# EasyEDA Pro project ProProject_Yuzuki Chameleon_2023-09-02.epro, board 100ASK
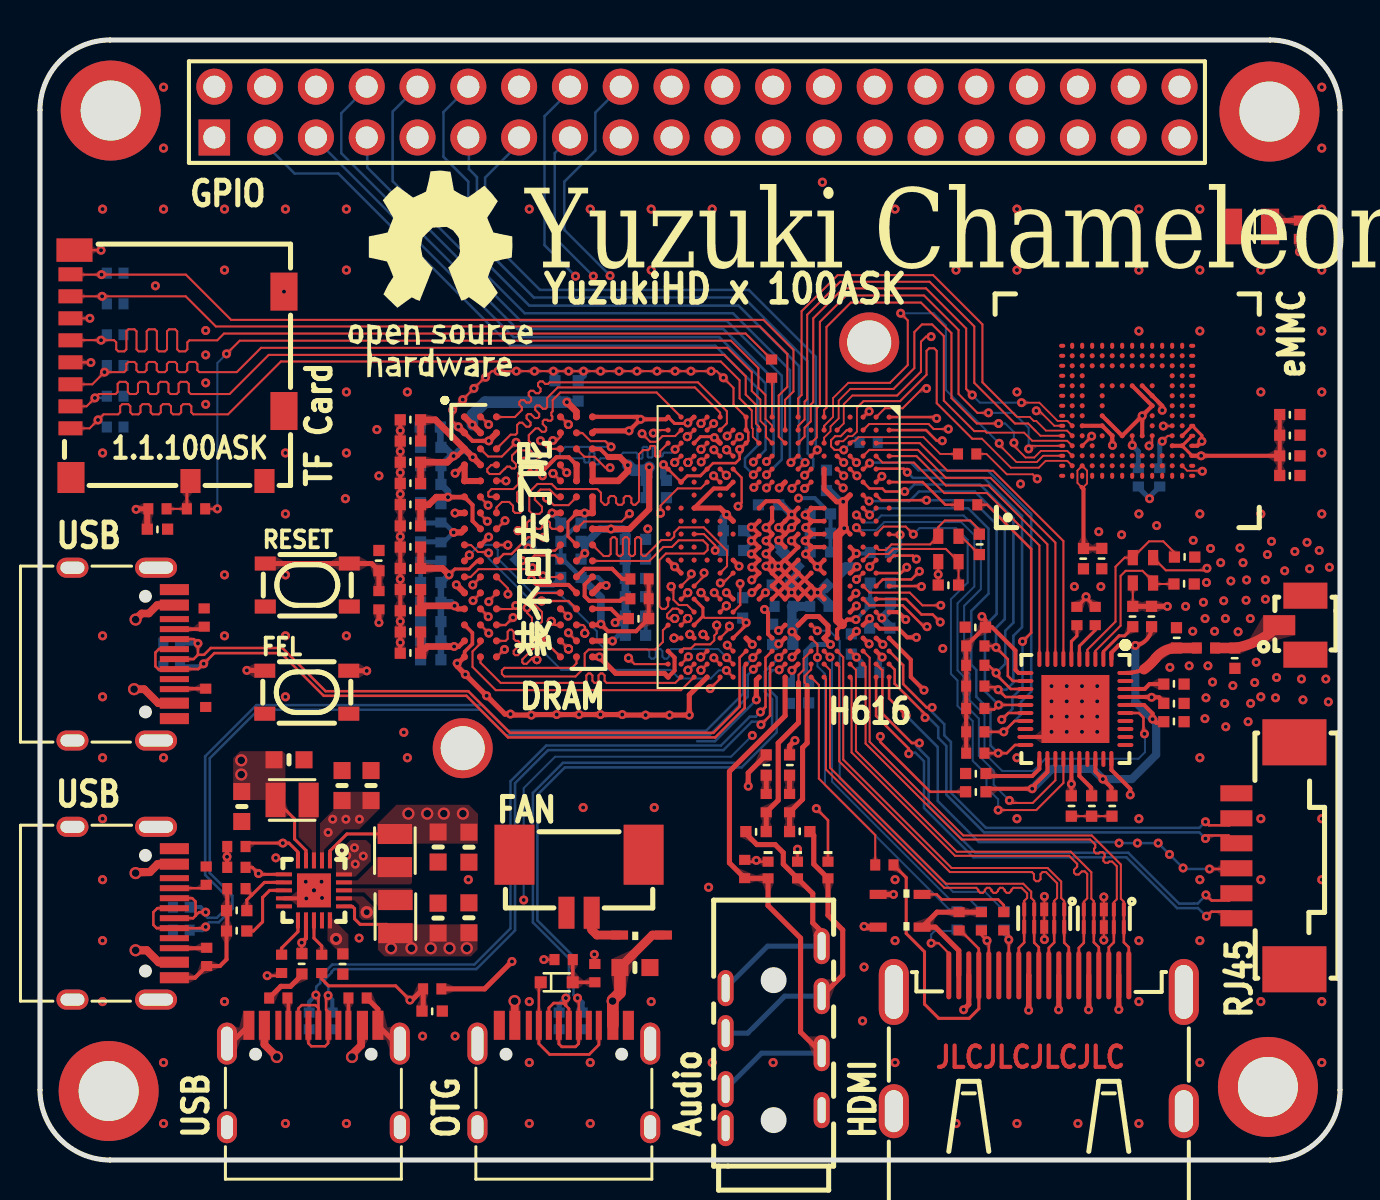
[diagram p14: board, top side]
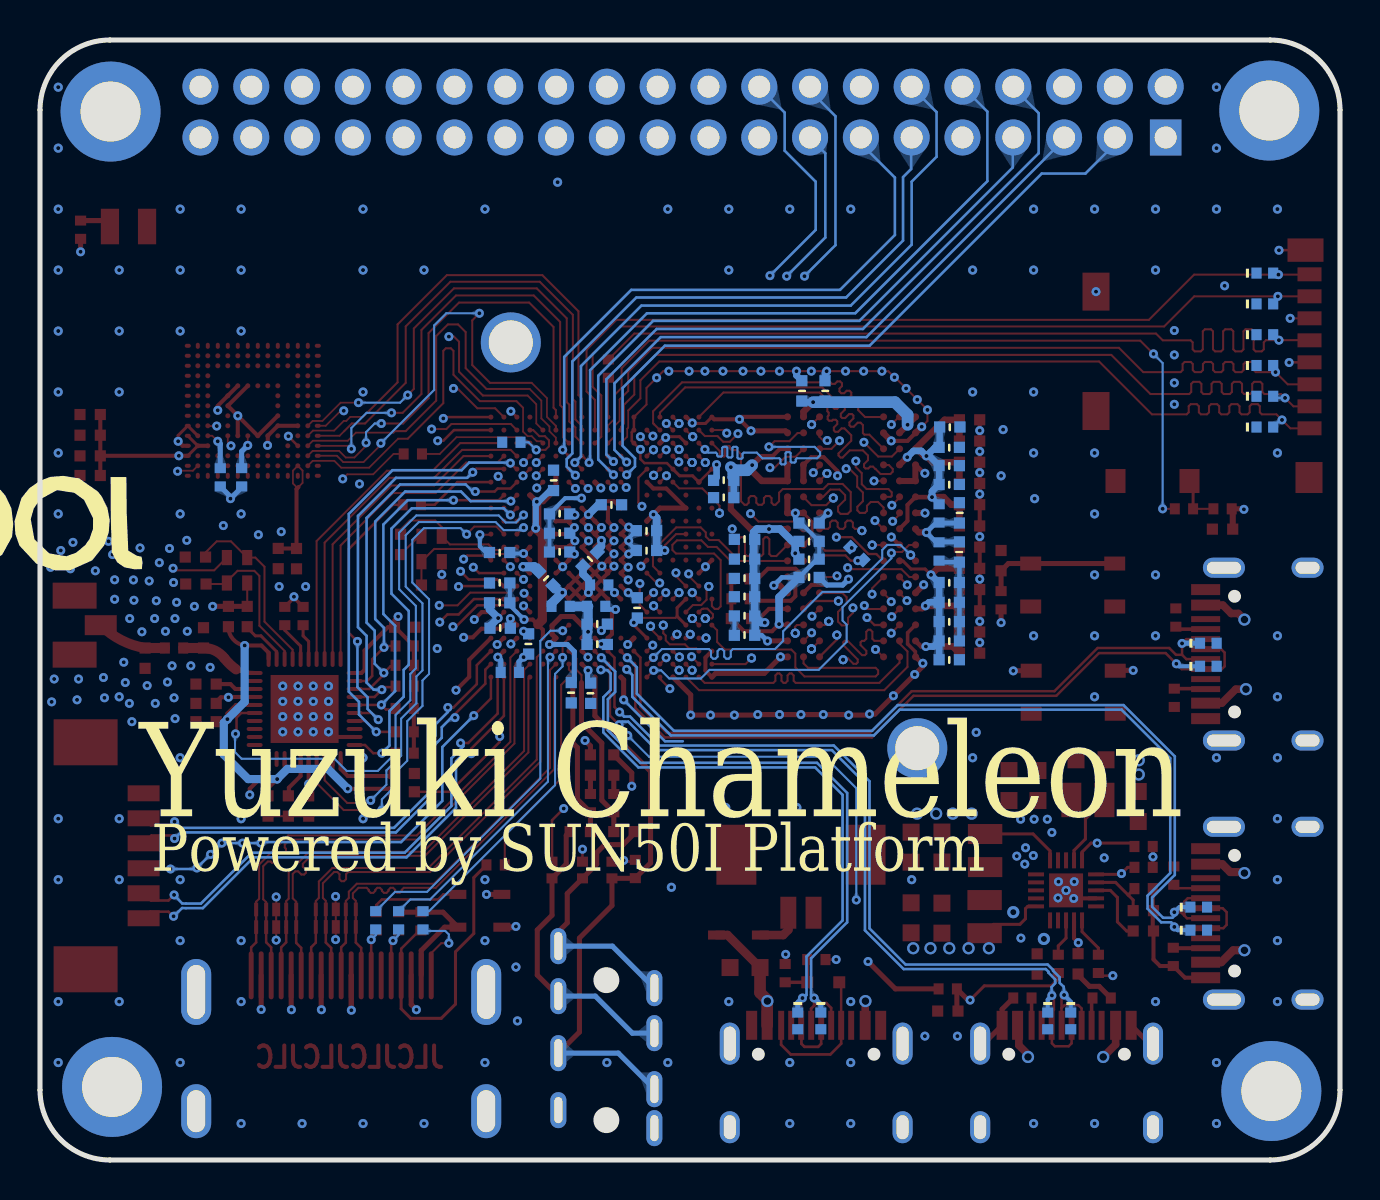
[diagram p15: board, bottom side, seen from below]

Outline 65 x 56 mm; copper layers: Top Layer, Inner1, Inner2, Inner3, Inner4, Bottom Layer. Coordinates in mm from the lower left corner of the outline.
Outline path: 0,52.5 0,3.5 arc(1.03,1.03) 3.5,0 61.5,0 arc(63.97,1.03) 65,3.5 65,52.5 arc(63.97,54.97) 61.5,56 3.5,56 arc(1.03,54.97) 0,52.5
Stack: Top Layer 0.035mm / Dielectric1 0.274mm PP er 4.5 / Inner1 0.035mm / Dielectric2 0.274mm PP er 4.5 / Inner2 0.035mm / Dielectric3 0.274mm FR4 er 4.5 / Inner3 0.035mm / Dielectric4 0.274mm PP er 4.5 / Inner4 0.035mm / Dielectric5 0.274mm PP er 4.5 / Bottom Layer 0.035mm

## Design rules (mm)
net SDQS1N: DP1
net SCKN: DP3
net SDQS1P: DP1
net SCKP: DP3
net HDMI_CP: DP5
net HDMI_0N: DP6
net HDMI_0P: DP6
net HDMI_1N: DP7
net HDMI_1P: DP7
net HDMI_2N: DP8
net HDMI_2P: DP8
net HDMI_CN: DP5
net D1+: DP4
net D1-: DP4
net D3+: DP10
net D3-: DP10
net D2+: DP9
net D2-: DP9
net D0+: DP11
net D0-: DP11
net EPHY_RXN: DP13
net EPHY_RXP: DP13
net EPHY_TXN: DP12
net EPHY_TXP: DP12
spacing safeClearance (default): track to track 0.089, other pairs 0.089 to 0.3
track width trackWidth (default): min 0.089, default 0.102, max 2.54
differential pair differentialPair (default): width min 0.102, default 0.254, max 2.54; gap min 0.102, default 0.102
via viaSize (default): diameter min 0.45, default 0.45, max 10; hole min 0.201, default 0.201, max 5.999
net VCC_DRAM uses DRAMCopper
pour e1065 uses DRAMCopper
pour e1494 uses DRAMCopper
pour e10340 uses DRAMCopper
pour e297 uses DRAMCopper

## Placement (name value [footprint] x y rotation side)
AUDIO1  -  [AUDIO-TH_PJ-3930-8A]  36.68 6.14 180 top
C1  4.7uf  [C0402-NSK]  15.14 9.8 90 top
C2  4.7uf  [C0603 NSK]  29.75 9.62 0 top
C3  4.7uf  [C0402-NSK]  13.1 9.81 90 top
C4  22uf  [C0603 NSK]  21.45 12.11 90 top
C5  4.7uf  [C0402-NSK]  9.83 12.47 0 top
C6  22uf  [C0603 NSK]  19.9 12.09 90 top
C7  4.7uf  [C0603 NSK]  16.55 18.72 90 top
C8  22uf  [C0603 NSK]  19.9 15.65 270 top
C9  22uf  [C0603 NSK]  21.45 15.64 270 top
C10  4.7uf  [C0603 NSK]  15.1 18.72 90 top
C11  22uf  [C0603 NSK]  10.09 17.67 270 top
C12  1uf  [C0402-NSK]  9.83 11.45 0 top
C13  22uf  [C0603 NSK]  12.45 20.01 0 top
C14  100nF  [C0402-NSK]  38.43 23.36 90 bottom
C15  100nF  [C0402-NSK]  37.47 23.34 90 bottom
C16  100nF  [C0402-NSK]  35.13 27.61 90 bottom
C17  100nF  [C0402-NSK]  29.77 30.04 180 bottom
C18  100nF  [C0402-NSK]  34.67 30.48 0 bottom
C19  100nF  [C0402-NSK]  29.77 31.03 180 bottom
C20  100nF  [C0402-NSK]  34.67 31.47 0 bottom
C21  100nF  [C0402-NSK]  39.02 31.34 180 bottom
C22  100nF  [C0402-NSK]  39.02 30.4 180 bottom
C23  100nF  [C0402-NSK]  39.02 32.3 180 bottom
C24  100nF  [C0402-NSK]  37.49 30.04 135 bottom
C25  100nF  [C0402-NSK]  36.43 32.76 0 bottom
C26  100nF  [C0402-NSK]  42.02 27.86 180 bottom
C27  100nF  [C0402-NSK]  39.32 33.98 270 bottom
C28  100nF  [C0402-NSK]  5.87 31.54 180 top
C29  100nF  [C0402-NSK]  42.02 28.85 180 bottom
C30  100nF  [C0402-NSK]  29.77 26.23 180 bottom
C31  100nF  [C0402-NSK]  19.54 27.89 0 bottom
C32  100nF  [C0402-NSK]  29.93 27.07 180 top
C33  100nF  [C0402-NSK]  19.54 28.88 0 bottom
C34  100nF  [C0402-NSK]  19.54 33.78 0 bottom
C35  100nF  [C0402-NSK]  18.52 32.77 0 top
C36  100nF  [C0402-NSK]  18.52 34.89 0 top
C37  100nF  [C0402-NSK]  19.54 26.92 0 bottom
C38  100nF  [C0402-NSK]  19.54 25.01 0 bottom
C39  100nF  [C0402-NSK]  29.77 27.2 180 bottom
C40  100nF  [C0402-NSK]  19.54 35.63 0 bottom
C41  100nF  [C0402-NSK]  26.55 31.85 180 bottom
C42  100nF  [C0402-NSK]  18.52 33.83 0 top
C43  100nF  [C0402-NSK]  18.52 35.95 0 top
C44  100nF  [C0402-NSK]  25.75 38.46 270 bottom
C45  100nF  [C0402-NSK]  29.77 28.16 180 bottom
C46  100nF  [C0402-NSK]  19.51 36.65 0 bottom
C47  100nF  [C0402-NSK]  30.81 33.12 180 bottom
C48  100nF  [C0402-NSK]  18.52 25.34 0 top
C49  100nF  [C0402-NSK]  18.52 31.7 0 top
C50  100nF  [C0402-NSK]  18.52 27.46 0 top
C51  100nF  [C0402-NSK]  26.91 38.46 270 bottom
C52  100nF  [C0402-NSK]  29.77 29.08 180 bottom
C53  100nF  [C0402-NSK]  18.52 37.01 0 top
C54  100nF  [C0402-NSK]  18.52 26.4 0 top
C55  100nF  [C0402-NSK]  18.52 30.64 0 top
C56  100nF  [C0402-NSK]  18.52 29.58 0 top
C57  100nF  [C0402-NSK]  18.52 28.52 0 top
C58  100nF  [C0402-NSK]  26.55 29.13 180 bottom
C59  100nF  [C0402-NSK]  19.03 32.36 270 bottom
C60  100nF  [C0402-NSK]  19.03 30.4 90 bottom
C61  100nF  [C0402-NSK]  19.54 25.95 0 bottom
C62  100nF  [C0402-NSK]  26.55 30.04 0 bottom
C63  100nF  [C0402-NSK]  26.55 30.93 0 bottom
C64  100nF  [C0402-NSK]  19.54 34.72 0 bottom
C65  100nF  [C0402-NSK]  30.81 33.98 180 bottom
C66  NC  [C0402-NSK]  56.82 26.11 270 top
C67  NC  [C0402-NSK]  59.74 25.09 90 top
C68  1uF  [C0402-NSK]  46.77 26.64 180 top
C69  1uF  [C0402-NSK]  51.57 17.7 270 top
C70  1uF  [C0402-NSK]  54.64 27.17 90 top
C71  1uF  [C0402-NSK]  56.7 23.8 0 top
C72  1uF  [C0402-NSK]  52.58 17.7 270 top
C73  1uF  [C0402-NSK]  46.79 19.33 180 top
C74  1uF  [C0402-NSK]  46.79 18.41 180 top
C75  2.2uF  [C0402-NSK]  62.49 34.22 180 top
C76  2.2uF  [C0402-NSK]  62.49 35.21 180 top
C77  2.2uF  [C0402-NSK]  62.49 36.24 180 top
C78  1uF  [C0402-NSK]  55.58 27.17 90 top
C79  1uF  [C0402-NSK]  56.7 21.92 0 top
C80  22pf  [C0402-NSK]  57.2 28.8 0 top
C81  2.2uF  [C0402-NSK]  62.49 37.27 180 top
C82  2.2uF  [C0402-NSK]  52.17 30.07 90 top
C83  2.2uF  [C0402-NSK]  53.09 30.07 90 top
C84  1uF  [C0402-NSK]  53.6 17.7 270 top
C85  22pf  [C0402-NSK]  57.23 30.15 0 top
C86  100nF  [c0402-nsk_1]  56.7 22.83 180 top
C87  100nF  [C0402-NSK]  16.95 29.97 90 top
C88  100nF  [C0402-NSK]  36.31 19.75 270 top
C89  4.7uF  [C0402-NSK]  35.8 16.42 180 top
C90  100nF  [C0402-NSK]  37.48 19.75 270 top
C91  4.7uF  [C0402-NSK]  37.99 16.42 0 top
C92  470nF  [C0402-NSK]  37.14 25.78 180 bottom
C93  470nF  [C0402-NSK]  37.14 26.79 180 bottom
C94  22pf  [C0402-NSK]  46.97 30.78 270 top
C95  2.2uF  [C0402-NSK]  40.57 25.8 90 bottom
C96  1uF  [C0402-NSK]  41.99 26.59 180 bottom
C97  220nF  [C0402-NSK]  39.7 29.08 225 bottom
C98  100nf  [C0402-NSK]  42.02 30.37 0 bottom
C99  22pf  [C0402-NSK]  45.42 28.75 180 top
C100  100nF  [C0402-NSK]  19.61 7.45 180 top
CN1  -  [CONN-SMD_6P-P1.25_53261-0671]  61.27 15.21 90 top
D1  -  [SOD-323_L1.8-W1.3-LS2.5-NSK]  30.08 11.25 0 top
D2  -  [D0402]  3.76 36.65 180 bottom
D3  -  [D0402]  3.76 38.19 180 bottom
D4  -  [D0402]  3.76 39.73 180 bottom
D5  -  [D0402]  3.76 41.27 180 bottom
D6  -  [D0402]  3.76 42.81 180 bottom
D7  -  [D0402]  3.76 44.34 180 bottom
D8  -  [D0402]  37.88 14.5 270 top
D9  -  [D0402]  25.96 6.95 270 bottom
D10  -  [D0402]  39.4 14.5 270 top
D11  -  [D0402]  27.11 6.95 270 bottom
D12  -  [D0402]  36.4 14.5 270 top
D13  -  [D0402]  6.58 25.84 180 bottom
D14  -  [D0402]  6.58 24.69 180 bottom
D15  -  [D0402]  13.46 6.95 270 bottom
D16  -  [D0402]  14.61 6.95 270 bottom
D17  -  [D0402]  7.06 12.64 180 bottom
D18  -  [D0402]  7.06 11.49 180 bottom
D19  -  [SLP2510P8_L2.5-W1.0-P0.50-BL]  53.19 12.09 180 top
D20  -  [SOD-523_L1.2-W0.8-LS1.6-FD]  25.84 8.89 180 top
D21  -  [SLP2510P8_L2.5-W1.0-P0.50-BL]  50.21 12.09 180 top
D22  -  [SOD-323_L1.8-W1.3-LS2.5-NSK]  43.01 11.64 180 top
D23  -  [SOD-323_L1.8-W1.3-LS2.5-NSK]  43.01 13.28 180 top
FAN1  -  [CONN-SMD_2P-P1.25_053398-0X71]  26.95 13.81 180 top
FEL  -  [KEY-SMD_4P-L4.2-W3.2-P2.20-LS4.6_1]  13.34 23.39 0 top
H1  -  [HDR-TH_40P-P2.54-V-M-R2-C20-S2.54]  32.85 52.4 0 top
HDMIOUT  -  [HDMI-SMD_HDMI-019S]  49.94 5.84 0 top
JP1  -  [RF-SMD_734120114]  62.61 26.74 90 top
L1  1uH  [IND-SMD_L2.0-W1.6_1]  17.77 12.17 90 top
L2  1uH  [IND-SMD_L2.0-W1.6_1]  17.74 15.47 270 top
L3  1uH  [IND-SMD_L2.0-W1.6_1]  12.61 18 0 top
LED1  -  [RGBLED_0807]  60.59 46.67 180 top
NOREF  -  [Pad_e2]  21.14 20.59 90 top
NOREF#2  -  [Pad_e8]  3.43 3.45 0 top
NOREF#3  -  [Pad_e0]  41.46 40.88 90 top
NOREF#4  -  [Pad_e4]  61.4 3.65 0 top
NOREF#5  -  [Pad_e5]  3.53 52.47 0 top
NOREF#6  -  [Pad_e6]  61.47 52.42 0 top
R1  510  [R0402-NSK_2]  9.82 13.57 0 top
R2  2k  [R0402-NSK_2]  9.82 15.67 0 top
R3  2k  [R0402-NSK_2]  9.82 14.63 0 top
R4  0  [R0402-NSK_2]  12.08 9.81 90 top
R5  0  [R0402-NSK_2]  14.09 9.81 90 top
R6  240  [R0402-NSK_2]  37.04 28.75 0 bottom
R7  100  [R0402-NSK_2]  24.16 30.32 225 bottom
R8  240  [R0402-NSK_2]  29.98 29.05 180 top
R9  240  [R0402-NSK_2]  29.98 28.06 180 top
R10  2k  [R0402-NSK_2]  20.05 32.33 90 bottom
R11  2k  [R0402-NSK_2]  20.05 30.43 90 bottom
R12  33  [R0402-NSK_2]  46.36 35.3 180 top
R13  33  [R0402-NSK_2]  36.58 39.57 270 top
R14  33  [R0402-NSK_2]  46.41 32.76 180 top
R15  1K  [R0402-NSK_2]  7.8 32.56 180 top
R16  47K  [R0402-NSK_2]  5.87 32.56 0 top
R17  47K  [R0402-NSK_2]  46.77 20.34 0 top
R18  0  [R0402-NSK_2]  58.3 25.6 0 top
R19  47K  [R0402-NSK_2]  51.85 27.2 270 top
R20  47K  [R0402-NSK_2]  52.76 27.2 270 top
R21  47K  [R0402-NSK_2]  46.77 25.7 0 top
R22  47K  [R0402-NSK_2]  46.77 24.74 0 top
R23  47K  [R0402-NSK_2]  46.77 23.69 0 top
R24  47K  [R0402-NSK_2]  46.77 21.41 0 top
R25  47K  [R0402-NSK_2]  46.77 22.58 0 top
R26  6.04k  [R0402-NSK_2]  41.51 24.38 180 bottom
R27  22  [R0402-NSK_2]  36.31 17.84 270 top
R28  510  [R0402-NSK_2]  16.95 27.99 90 top
R29  22  [R0402-NSK_2]  37.48 17.84 270 top
R30  75  [R0402-NSK_2]  35.23 14.55 270 top
R31  150K  [R0402-NSK_2]  37.19 27.68 180 bottom
R32  0  [R0402-NSK_2]  38.97 27.68 180 bottom
R33  47k  [R0402-NSK_2]  26.18 10.02 180 top
R34  1K  [R0402-NSK_2]  27.74 9.34 270 top
R35  5.1k  [R0402-NSK_2]  8.21 27.12 270 top
R36  5.1k  [R0402-NSK_2]  8.28 23.11 270 top
R37  27K  [R0402-NSK_2]  48.19 11.93 270 top
R38  100  [R0402-NSK_2]  48.21 11.98 270 bottom
R39  1k  [R0402-NSK_2]  45.85 11.98 270 bottom
R40  5.1k  [R0402-NSK_2]  8.31 14.22 270 top
R41  10K  [R0402-NSK_2]  47.07 11.93 270 top
R42  100  [R0402-NSK_2]  47.07 11.98 270 bottom
R43  5.1k  [R0402-NSK_2]  8.34 10.16 270 top
R44  5.1k  [R0402-NSK_2]  11.92 8.1 0 top
R45  100  [R0402-NSK_2]  42.22 14.75 0 top
R46  5.1k  [R0402-NSK_2]  15.88 8.1 0 top
R47  10K  [R0402-NSK_2]  45.95 11.93 270 top
R48  5.1k  [R0402-NSK_2]  62.97 46.51 270 top
R49  10K  [R0402-NSK_2]  19.61 8.56 0 top
R50  47K  [R0402-NSK_2]  55.99 34.13 90 bottom
R51  47K  [R0402-NSK_2]  54.92 34.13 90 bottom
R52  10k  [R0402-NSK_2]  41.43 35.89 0 bottom
RESET  -  [KEY-SMD_4P-L4.2-W3.2-P2.20-LS4.6_1]  13.36 28.75 0 top
SIM1  -  [SIM-SMD_8P-1040310811]  6.86 39.72 270 top
U1  AXP313A  [WQFN-20_L3.0-W3.0-P0.40-BL-EP]  13.7 13.48 180 top
U2  -  [FBGA96]  24.48 31.03 0 top
U3  XR829  [QFN-40_L5.0-W5.0-P0.40-BL-EP3.4]  51.77 22.55 180 top
U4  -  [FBGA-153_L13.0-W11.5]  54.36 37.46 90 top
U5  -  [BGA284P65B1200_1400H125]  36.93 30.65 270 top
USB1  -  [USB-C-SMD_TYPEC-304-BCP16-1]  26.19 4.19 0 top
USB2  -  [USB-C-SMD_TYPEC-304-BCP16-1]  4.17 25.29 270 top
USB3  -  [USB-C-SMD_TYPEC-304-BCP16-1]  4.17 12.34 270 top
USB4  -  [USB-C-SMD_TYPEC-304-BCP16-1]  13.67 4.19 0 top
X1  -  [OSC-SMD_4P-L2.0-W1.6-BL]  55.15 29.49 90 top
X2  -  [OSC-SMD_4P-L2.0-W1.6-BL]  45.42 30.55 270 top

## Footprints (pads in the part's own frame, mm; a bottom-side part is the same pattern mirrored in y, then rotated)
AUDIO-TH_PJ-3930-8A
  oval 0.8x1.801 hole 0.399x1.3: 1(-2.401,3.65) 8(2.401,4.549)
  oval 0.8x1.801 hole 0.399x1.399: 2(2.401,-2.451) 3(-2.401,-2.05) 4(-2.401,0.8) 5(-2.401,-4.549) 6(2.401,-0.201) 7(2.401,2.601)
BGA284P65B1200_1400H125
  round 0.254 smd: A1(-6.5,5.525) A2(-5.85,5.525) A4(-4.55,5.525) A6(-3.25,5.525) A8(-1.95,5.525) A10(-0.65,5.525) A12(0.65,5.525) A14(1.95,5.525) A16(3.25,5.525) A18(4.55,5.525) A19(5.2,5.525) A20(5.85,5.525) A21(6.5,5.525) B1(-6.5,4.875) B2(-5.85,4.875) B3(-5.2,4.875) B4(-4.55,4.875) B5(-3.9,4.875) B6(-3.25,4.875) B7(-2.6,4.875) B8(-1.95,4.875) B9(-1.3,4.875) B10(-0.65,4.875) B11(0,4.875) B12(0.65,4.875) B13(1.3,4.875) B14(1.95,4.875) B15(2.6,4.875) B16(3.25,4.875) B17(3.9,4.875) B18(4.55,4.875) B19(5.2,4.875) B20(5.85,4.875) B21(6.5,4.875) C1(-6.5,4.225) C2(-5.85,4.225) C3(-5.2,4.225) C4(-4.55,4.225) C5(-3.9,4.225) C6(-3.25,4.225) C7(-2.6,4.225) C8(-1.95,4.225) C9(-1.3,4.225) C10(-0.65,4.225) C11(0,4.225) C12(0.65,4.225) C13(1.3,4.225) C14(1.95,4.225) C15(2.6,4.225) C16(3.25,4.225) C17(3.9,4.225) C18(4.55,4.225) C19(5.2,4.225) C20(5.85,4.225) D1(-6.5,3.575) D2(-5.85,3.575) D3(-5.2,3.575) D4(-4.55,3.575) D5(-3.9,3.575) D7(-2.6,3.575) D10(-0.65,3.575) D11(0,3.575) D12(0.65,3.575) D13(1.3,3.575) D14(1.95,3.575) D15(2.6,3.575) D16(3.25,3.575) D18(4.55,3.575) D19(5.2,3.575) D20(5.85,3.575) D21(6.5,3.575) E2(-5.85,2.925) E3(-5.2,2.925) E4(-4.55,2.925) E5(-3.9,2.925) E6(-3.25,2.925) E18(4.55,2.925) E19(5.2,2.925) E20(5.85,2.925) F1(-6.5,2.275) F2(-5.85,2.275) F3(-5.2,2.275) F4(-4.55,2.275) F5(-3.9,2.275) F8(-1.95,2.275) F9(-1.3,2.275) F10(-0.65,2.275) F11(0,2.275) F12(0.65,2.275) F13(1.3,2.275) F14(1.95,2.275) F15(2.6,2.275) F18(4.55,2.275) F19(5.2,2.275) F20(5.85,2.275) F21(6.5,2.275) G2(-5.85,1.625) G3(-5.2,1.625) G4(-4.55,1.625) G5(-3.9,1.625) G6(-3.25,1.625) G8(-1.95,1.625) G9(-1.3,1.625) G10(-0.65,1.625) G11(0,1.625) G12(0.65,1.625) G13(1.3,1.625) G14(1.95,1.625) G15(2.6,1.625) G17(3.9,1.625) G18(4.55,1.625) G19(5.2,1.625) G20(5.85,1.625) G21(6.5,1.625) H1(-6.5,0.975) H2(-5.85,0.975) H3(-5.2,0.975) H4(-4.55,0.975) H5(-3.9,0.975) H6(-3.25,0.975) H8(-1.95,0.975) H9(-1.3,0.975) H10(-0.65,0.975) H11(0,0.975) H12(0.65,0.975) H13(1.3,0.975) H14(1.95,0.975) H15(2.6,0.975) H17(3.9,0.975) H18(4.55,0.975) H19(5.2,0.975) H20(5.85,0.975) J2(-5.85,0.325) J3(-5.2,0.325) J6(-3.25,0.325) J8(-1.95,0.325) J9(-1.3,0.325) J10(-0.65,0.325) J11(0,0.325) J12(0.65,0.325) J13(1.3,0.325) J14(1.95,0.325) J15(2.6,0.325) J17(3.9,0.325) J18(4.55,0.325) J19(5.2,0.325) J20(5.85,0.325) J21(6.5,0.325) K1(-6.5,-0.325) K2(-5.85,-0.325) K3(-5.2,-0.325) K4(-4.55,-0.325) K5(-3.9,-0.325) K6(-3.25,-0.325) K8(-1.95,-0.325) K9(-1.3,-0.325) K10(-0.65,-0.325) K11(0,-0.325) K12(0.65,-0.325) K13(1.3,-0.325) K14(1.95,-0.325) K15(2.6,-0.325) K18(4.55,-0.325) K19(5.2,-0.325) K20(5.85,-0.325) L2(-5.85,-0.975) L3(-5.2,-0.975) L4(-4.55,-0.975) L5(-3.9,-0.975) L6(-3.25,-0.975) L8(-1.95,-0.975) L9(-1.3,-0.975) L10(-0.65,-0.975) L11(0,-0.975) L12(0.65,-0.975) L13(1.3,-0.975) L14(1.95,-0.975) L15(2.6,-0.975) L18(4.55,-0.975) L19(5.2,-0.975) L20(5.85,-0.975) L21(6.5,-0.975) M1(-6.5,-1.625) M2(-5.85,-1.625) M3(-5.2,-1.625) M18(4.55,-1.625) M19(5.2,-1.625) M20(5.85,-1.625) N2(-5.85,-2.275) N3(-5.2,-2.275) N4(-4.55,-2.275) N5(-3.9,-2.275) N6(-3.25,-2.275) N7(-2.6,-2.275) N9(-1.3,-2.275) N10(-0.65,-2.275) N12(0.65,-2.275) N13(1.3,-2.275) N15(2.6,-2.275) N16(3.25,-2.275) N18(4.55,-2.275) N19(5.2,-2.275) N20(5.85,-2.275) N21(6.5,-2.275) P1(-6.5,-2.925) P2(-5.85,-2.925) P3(-5.2,-2.925) P4(-4.55,-2.925) P5(-3.9,-2.925) P6(-3.25,-2.925) P7(-2.6,-2.925) P9(-1.3,-2.925) P10(-0.65,-2.925) P12(0.65,-2.925) P13(1.3,-2.925) P15(2.6,-2.925) P16(3.25,-2.925) P18(4.55,-2.925) P20(5.85,-2.925) P21(6.5,-2.925) R1(-6.5,-3.575) R2(-5.85,-3.575) R3(-5.2,-3.575) R4(-4.55,-3.575) R5(-3.9,-3.575) R6(-3.25,-3.575) R9(-1.3,-3.575) R12(0.65,-3.575) R15(2.6,-3.575) R18(4.55,-3.575) R19(5.2,-3.575) R20(5.85,-3.575) R21(6.5,-3.575) T1(-6.5,-4.225) T2(-5.85,-4.225) T3(-5.2,-4.225) T4(-4.55,-4.225) T5(-3.9,-4.225) T6(-3.25,-4.225) T7(-2.6,-4.225) T8(-1.95,-4.225) T9(-1.3,-4.225) T10(-0.65,-4.225) T11(0,-4.225) T12(0.65,-4.225) T14(1.95,-4.225) T15(2.6,-4.225) T16(3.25,-4.225) T17(3.9,-4.225) T18(4.55,-4.225) T20(5.85,-4.225) T21(6.5,-4.225) U1(-6.5,-4.875) U2(-5.85,-4.875) U3(-5.2,-4.875) U4(-4.55,-4.875) U5(-3.9,-4.875) U6(-3.25,-4.875) U8(-1.95,-4.875) U9(-1.3,-4.875) U10(-0.65,-4.875) U11(0,-4.875) U12(0.65,-4.875) U13(1.3,-4.875) U14(1.95,-4.875) U15(2.6,-4.875) U16(3.25,-4.875) U17(3.9,-4.875) U18(4.55,-4.875) U19(5.2,-4.875) U20(5.85,-4.875) U21(6.5,-4.875) V1(-6.5,-5.525) V2(-5.85,-5.525) V3(-5.2,-5.525) V5(-3.9,-5.525) V8(-1.95,-5.525) V10(-0.65,-5.525) V12(0.65,-5.525) V15(2.6,-5.525) V17(3.9,-5.525) V19(5.2,-5.525) V20(5.85,-5.525) V21(6.5,-5.525)
C0402-NSK
  rect 0.559x0.559 smd: 1(-0.508,0) 2(0.508,0)
c0402-nsk_1
  rect 0.559x0.559 smd: 1(-0.508,0) 2(0.508,0)
C0603 NSK
  rect 0.85x0.85 smd: 1(-0.75,0) 2(0.75,0)
CONN-SMD_2P-P1.25_053398-0X71
  rect 0.8x1.6 smd: 1(-0.63,1.45) 2(0.63,1.45)
  rect 1.999x2.999 smd: 3(3.231,-1.45) 4(-3.228,-1.45)
CONN-SMD_6P-P1.25_53261-0671
  rect 0.8x1.6 smd: 1(3.124,1.45) 2(1.875,1.45) 3(0.625,1.45) 4(-0.625,1.45) 5(-1.875,1.45) 6(-3.124,1.45)
  rect 2.301x3.2 smd: 7(-5.675,-1.45) 8(5.675,-1.45)
D0402
  rect 0.505x0.551 smd: 1(-0.416,0) 2(0.416,0)
FBGA96
  round 0.355 smd: A1(-3.261,6.131) A2(-2.462,6.131) A3(-1.661,6.131) A7(1.539,6.131) A8(2.34,6.131) A9(3.139,6.131) B1(-3.261,5.332) B2(-2.462,5.332) B3(-1.661,5.332) B7(1.539,5.332) B8(2.34,5.332) B9(3.139,5.332) C1(-3.261,4.532) C2(-2.462,4.532) C3(-1.661,4.532) C7(1.539,4.532) C8(2.34,4.532) C9(3.139,4.532) D1(-3.261,3.732) D2(-2.462,3.732) D3(-1.661,3.732) D7(1.539,3.732) D8(2.34,3.732) D9(3.139,3.732) E1(-3.261,2.931) E2(-2.462,2.931) E3(-1.661,2.931) E7(1.539,2.931) E8(2.34,2.931) E9(3.139,2.931) F1(-3.261,2.131) F2(-2.462,2.131) F3(-1.661,2.131) F7(1.539,2.131) F8(2.34,2.131) F9(3.139,2.131) G1(-3.261,1.331) G2(-2.462,1.331) G3(-1.661,1.331) G7(1.539,1.331) G8(2.34,1.331) G9(3.139,1.331) H1(-3.261,0.531) H2(-2.462,0.531) H3(-1.661,0.531) H7(1.539,0.531) H8(2.34,0.531) H9(3.139,0.531) J1(-3.261,-0.269) J2(-2.462,-0.269) J3(-1.661,-0.269) J7(1.539,-0.269) J8(2.34,-0.269) J9(3.139,-0.269) K1(-3.261,-1.069) K2(-2.462,-1.069) K3(-1.661,-1.069) K7(1.539,-1.069) K8(2.34,-1.069) K9(3.139,-1.069) L1(-3.261,-1.869) L2(-2.462,-1.869) L3(-1.661,-1.869) L7(1.539,-1.869) L8(2.34,-1.869) L9(3.139,-1.869) M1(-3.261,-2.67) M2(-2.462,-2.67) M3(-1.661,-2.67) M7(1.539,-2.67) M8(2.34,-2.67) M9(3.139,-2.67) N1(-3.261,-3.47) N2(-2.462,-3.47) N3(-1.661,-3.47) N7(1.539,-3.47) N8(2.34,-3.47) N9(3.139,-3.47) P1(-3.261,-4.269) P2(-2.462,-4.269) P3(-1.661,-4.269) P7(1.539,-4.269) P8(2.34,-4.269) P9(3.139,-4.269) R1(-3.261,-5.07) R2(-2.462,-5.07) R3(-1.661,-5.07) R7(1.539,-5.07) R8(2.34,-5.07) R9(3.139,-5.07) T1(-3.261,-5.87) T2(-2.462,-5.87) T3(-1.661,-5.87) T7(1.539,-5.87) T8(2.34,-5.87) T9(3.139,-5.87)
FBGA-153_L13.0-W11.5
  oval 0.2x0.305 smd: A1(-3.25,3.25) A2(-2.75,3.25) A3(-2.25,3.25) A4(-1.75,3.25) A5(-1.25,3.25) A6(-0.75,3.25) A7(-0.25,3.25) A8(0.25,3.25) A9(0.75,3.25) A10(1.25,3.25) A11(1.75,3.25) A12(2.25,3.25) A13(2.75,3.25) A14(3.25,3.25) P1(-3.25,-3.25) P2(-2.75,-3.25) P3(-2.25,-3.25) P4(-1.75,-3.25) P5(-1.25,-3.25) P6(-0.75,-3.25) P7(-0.25,-3.25) P8(0.25,-3.25) P9(0.75,-3.25) P10(1.25,-3.25) P11(1.75,-3.25) P12(2.25,-3.25) P13(2.75,-3.25) P14(3.25,-3.25)
  oval 0.305x0.2 smd: B1(-3.25,2.75) B14(3.25,2.75) C1(-3.25,2.25) C14(3.25,2.25) D1(-3.25,1.75) D14(3.25,1.75) E1(-3.25,1.25) E14(3.25,1.25) F1(-3.25,0.75) F14(3.25,0.75) G1(-3.25,0.25) G14(3.25,0.25) H1(-3.25,-0.25) H14(3.25,-0.25) J1(-3.25,-0.75) J14(3.25,-0.75) K1(-3.25,-1.25) K14(3.25,-1.25) L1(-3.25,-1.75) L14(3.25,-1.75) M1(-3.25,-2.25) M14(3.25,-2.25) N1(-3.25,-2.75) N14(3.25,-2.75)
  round 0.25 smd: B2(-2.75,2.75) B3(-2.25,2.75) B4(-1.75,2.75) B5(-1.25,2.75) B6(-0.75,2.75) B7(-0.25,2.75) B8(0.25,2.75) B9(0.75,2.75) B10(1.25,2.75) B11(1.75,2.75) B12(2.25,2.75) B13(2.75,2.75) C2(-2.75,2.25) C3(-2.25,2.25) C4(-1.75,2.25) C5(-1.25,2.25) C6(-0.75,2.25) C7(-0.25,2.25) C8(0.25,2.25) C9(0.75,2.25) C10(1.25,2.25) C11(1.75,2.25) C12(2.25,2.25) C13(2.75,2.25) D2(-2.75,1.75) D3(-2.25,1.75) D4(-1.75,1.75) D12(2.25,1.75) D13(2.75,1.75) E2(-2.75,1.25) E3(-2.25,1.25) E5(-1.25,1.25) E6(-0.75,1.25) E7(-0.25,1.25) E8(0.25,1.25) E9(0.75,1.25) E10(1.25,1.25) E12(2.25,1.25) E13(2.75,1.25) F2(-2.75,0.75) F3(-2.25,0.75) F5(-1.25,0.75) F10(1.25,0.75) F12(2.25,0.75) F13(2.75,0.75) G2(-2.75,0.25) G3(-2.25,0.25) G5(-1.25,0.25) G10(1.25,0.25) G12(2.25,0.25) G13(2.75,0.25) H2(-2.75,-0.25) H3(-2.25,-0.25) H5(-1.25,-0.25) H10(1.25,-0.25) H12(2.25,-0.25) H13(2.75,-0.25) J2(-2.75,-0.75) J3(-2.25,-0.75) J5(-1.25,-0.75) J10(1.25,-0.75) J12(2.25,-0.75) J13(2.75,-0.75) K2(-2.75,-1.25) K3(-2.25,-1.25) K5(-1.25,-1.25) K6(-0.75,-1.25) K7(-0.25,-1.25) K8(0.25,-1.25) K9(0.75,-1.25) K10(1.25,-1.25) K12(2.25,-1.25) K13(2.75,-1.25) L2(-2.75,-1.75) L3(-2.25,-1.75) L12(2.25,-1.75) L13(2.75,-1.75) M2(-2.75,-2.25) M3(-2.25,-2.25) M4(-1.75,-2.25) M5(-1.25,-2.25) M6(-0.75,-2.25) M7(-0.25,-2.25) M8(0.25,-2.25) M9(0.75,-2.25) M10(1.25,-2.25) M11(1.75,-2.25) M12(2.25,-2.25) M13(2.75,-2.25) N2(-2.75,-2.75) N3(-2.25,-2.75) N4(-1.75,-2.75) N5(-1.25,-2.75) N6(-0.75,-2.75) N7(-0.25,-2.75) N8(0.25,-2.75) N9(0.75,-2.75) N10(1.25,-2.75) N11(1.75,-2.75) N12(2.25,-2.75) N13(2.75,-2.75)
HDMI-SMD_HDMI-019S
  oval 0.25x2.4 smd: 1(4.501,3.396) 2(4.001,3.396) 3(3.501,3.396) 4(3.001,3.396) 5(2.501,3.396) 6(2.001,3.396) 7(1.5,3.396) 8(1,3.396) 9(0.5,3.396) 10(0,3.396) 11(-0.5,3.396) 12(-1,3.396) 13(-1.5,3.396) 14(-2.001,3.396) 15(-2.501,3.396) 16(-3.001,3.396) 17(-3.501,3.396) 18(-4.001,3.396) 19(-4.501,3.396)
  oval 1.5x2.7 hole 0.9x2.1: 20(7.25,-3.397) 21(-7.25,-3.397)
  oval 1.5x3.3 hole 0.9x2.7: 22(7.25,2.564) 23(-7.25,2.564)
HDR-TH_40P-P2.54-V-M-R2-C20-S2.54
  rect 1.575x1.801 hole 1.1: 1(-24.13,-1.27)
  round 1.801 hole 1.1: 2(-24.13,1.27) 3(-21.59,-1.27) 4(-21.59,1.27) 5(-19.05,-1.27) 6(-19.05,1.27) 7(-16.51,-1.27) 8(-16.51,1.27) 9(-13.97,-1.27) 10(-13.97,1.27) 11(-11.43,-1.27) 12(-11.43,1.27) 13(-8.89,-1.27) 14(-8.89,1.27) 15(-6.35,-1.27) 16(-6.35,1.27) 17(-3.81,-1.27) 18(-3.81,1.27) 19(-1.27,-1.27) 20(-1.27,1.27) 21(1.27,-1.27) 22(1.27,1.27) 23(3.81,-1.27) 24(3.81,1.27) 25(6.35,-1.27) 26(6.35,1.27) 27(8.89,-1.27) 28(8.89,1.27) 29(11.43,-1.27) 30(11.43,1.27) 31(13.97,-1.27) 32(13.97,1.27) 33(16.51,-1.27) 34(16.51,1.27) 35(19.05,-1.27) 36(19.05,1.27) 37(21.59,-1.27) 38(21.59,1.27) 39(24.13,-1.27) 40(24.13,1.27)
IND-SMD_L2.0-W1.6_1
  rect 1x1.72 smd: 1(0.828,0) 2(-0.828,0)
KEY-SMD_4P-L4.2-W3.2-P2.20-LS4.6_1
  rect 1.049x0.701 smd: 1(-2.1,1.075) 2(2.1,1.075) 3(-2.1,-1.075) 4(2.1,-1.075)
OSC-SMD_4P-L2.0-W1.6-BL
  rect 0.762x0.508 smd: 1(-0.635,-0.508) 2(0.635,-0.508) 3(0.635,0.508) 4(-0.635,0.508)
Pad_e0
  round 3 hole 2.2: 1(0,0)
Pad_e2
  round 3 hole 2.2: 1(0,0)
Pad_e4
  round 5 hole 3: 1(0,0)
Pad_e5
  round 5 hole 3: 1(0,0)
Pad_e6
  round 5 hole 3: 1(0,0)
Pad_e8
  round 5 hole 3: 1(0,0)
QFN-40_L5.0-W5.0-P0.40-BL-EP3.4
  oval 0.2x0.8 smd: 1(-1.8,-2.499) 2(-1.4,-2.499) 3(-1,-2.499) 4(-0.6,-2.499) 5(-0.2,-2.499) 6(0.2,-2.499) 7(0.6,-2.499) 8(1,-2.499) 9(1.4,-2.499) 10(1.8,-2.499) 21(1.8,2.499) 22(1.4,2.499) 23(1,2.499) 24(0.6,2.499) 25(0.2,2.499) 26(-0.2,2.499) 27(-0.6,2.499) 28(-1,2.499) 29(-1.4,2.499) 30(-1.8,2.499)
  oval 0.8x0.2 smd: 11(2.499,-1.8) 12(2.499,-1.4) 13(2.499,-1) 14(2.499,-0.6) 15(2.499,-0.2) 16(2.499,0.2) 17(2.499,0.6) 18(2.499,1) 19(2.499,1.4) 20(2.499,1.8) 31(-2.499,1.8) 32(-2.499,1.4) 33(-2.499,1) 34(-2.499,0.6) 35(-2.499,0.2) 36(-2.499,-0.2) 37(-2.499,-0.6) 38(-2.499,-1) 39(-2.499,-1.4) 40(-2.499,-1.8)
  rect 3.4x3.4 smd: 41(0,0)
R0402-NSK_2
  rect 0.5x0.559 smd: 1(-0.457,0) 2(0.458,0)
RF-SMD_734120114
  rect 1x1.6 smd: 1(0,0.653)
  rect 1.3x2.2 smd: 2(-1.475,-0.653) 3(1.475,-0.653)
RGBLED_0807
  rect 0.91x1.778 smd: 1(-0.914,0) 2(0.94,0)
SIM-SMD_8P-1040310811
  rect 0.7x1.2 smd: 1(3.138,-5.338) 2(2.038,-5.338) 3(0.938,-5.338) 4(-0.163,-5.338) 5(-1.262,-5.338) 6(-2.362,-5.338) 7(-3.462,-5.338) 8(-4.562,-5.338)
  rect 1.17x1.8 smd: 9(-5.772,-5.138)
  rect 1.55x1.35 smd: 10(5.598,-5.312)
  rect 1.2x1 smd: 11(5.772,0.662) 12(5.772,4.362)
  rect 1.9x1.35 smd: 13(2.272,5.338) 14(-3.697,5.338)
SLP2510P8_L2.5-W1.0-P0.50-BL
  rect 0.201x0.68 smd: 1(-1.001,-0.44) 2(-0.5,-0.44) 4(0.5,-0.44) 5(1.001,-0.44) 6(1.001,0.44) 7(0.5,0.44) 9(-0.5,0.44) 10(-1.001,0.44)
  rect 0.399x0.68 smd: 3(0,-0.44) 8(0,0.44)
SOD-323_L1.8-W1.3-LS2.5-NSK
  rect 0.846x0.455 smd: 1(-1.097,0) 2(1.097,0)
SOD-523_L1.2-W0.8-LS1.6-FD
  rect 0.6x0.6 smd: 1(-0.8,0) 2(0.8,0)
USB-C-SMD_TYPEC-304-BCP16-1
  oval 1.001x2.1 hole 0.6x1.7: 12(-4.321,1.633) 13(4.321,1.633)
  oval 1.001x1.6 hole 0.6x1.199: 14(-4.321,-2.547) 15(4.321,-2.547)
  rect 0.551x1.45 smd: A1B12(-3.226,2.547) A4B9(-2.451,2.547) B1A12(3.226,2.547) B4A9(2.451,2.547)
  rect 0.299x1.45 smd: A5(-1.25,2.547) A6(-0.249,2.547) A7(0.249,2.547) A8(1.25,2.547) B5(1.75,2.547) B6(0.75,2.547) B7(-0.75,2.547) B8(-1.75,2.547)
WQFN-20_L3.0-W3.0-P0.40-BL-EP
  rect 0.201x0.8 smd: 1(-0.8,-1.501) 2(-0.402,-1.501) 3(0,-1.501) 4(0.399,-1.501) 5(0.8,-1.501) 11(0.8,1.501) 12(0.399,1.501) 13(0,1.501) 14(-0.402,1.501) 15(-0.8,1.501)
  rect 0.8x0.201 smd: 6(1.501,-0.8) 7(1.501,-0.399) 8(1.501,0) 9(1.501,0.399) 10(1.501,0.8) 16(-1.501,0.8) 17(-1.501,0.402) 18(-1.501,0) 19(-1.501,-0.399) 20(-1.501,-0.8)
  rect 1.7x1.7 smd: 21(0,0)

## Nets
As in the schematic, except:
GND: AUDIO1.1 AUDIO1.8 C1.1 C2.2 C3.1 C4.2 C5.1 C6.2 C7.2 C8.2 C9.2 C10.2 C11.2 C12.1 C13.2 C14.1 C15.1 C16.1 C17.1 C18.1 C19.1 C20.1 C21.1 C22.1 C23.1 C24.1 C25.1 C26.1 C27.1 C28.1 C29.1 C30.1 C31.1 C32.1 C33.1 C34.1 C35.1 C36.1 C37.1 C38.1 C39.1 C40.1 C41.1 C42.1 C43.1 C44.1 C45.1 C46.1 C47.1 C48.1 C49.1 C50.1 C51.1 C52.1 C53.1 C54.1 C55.1 C56.1 C57.1 C58.1 C59.1 C60.1 C61.1 C62.1 C63.1 C64.1 C65.1 C66.1 C67.1 C68.2 C69.2 C70.2 C71.2 C72.2 C73.2 C74.2 C75.1 C76.1 C77.1 C78.2 C79.2 C80.2 C81.1 C82.1 C83.1 C84.2 C85.2 C86.1 C87.2 C88.1 C90.1 C94.2 C95.1 C96.1 C97.2 C98.2 C99.2 C100.1 CN1.1 CN1.4 CN1.7 CN1.8 D2.1 D3.1 D4.1 D5.1 D6.1 D7.1 D8.1 D9.2 D10.1 D11.2 D12.1 D13.2 D14.2 D15.2 D16.2 D17.2 D18.2 D19.3 D19.8 D21.3 D21.8 FAN1.2 FAN1.3 FAN1.4 FEL.3 FEL.4 H1.6 H1.9 H1.14 H1.20 H1.25 H1.30 H1.34 H1.39 HDMIOUT.2 HDMIOUT.5 HDMIOUT.8 HDMIOUT.11 HDMIOUT.17 HDMIOUT.20 HDMIOUT.21 HDMIOUT.22 HDMIOUT.23 JP1.2 JP1.3 LED1.2 NOREF.1 NOREF#2.1 NOREF#3.1 NOREF#4.1 NOREF#5.1 NOREF#6.1 R1.1 R6.2 R8.1 R9.1 R11.1 R26.2 R30.1 R32.1 R35.1 R36.2 R40.1 R43.2 R44.1 R46.2 R52.2 RESET.3 RESET.4 SIM1.6 SIM1.9 SIM1.10 SIM1.12 SIM1.13 SIM1.14 U1.9 U1.21 U2.A9 U2.B1 U2.B3 U2.B9 U2.D1 U2.D8 U2.E1 U2.E2 U2.E8 U2.F9 U2.G1 U2.G8 U2.G9 U2.J2 U2.J8 U2.M1 U2.M9 U2.P1 U2.P9 U2.T1 U2.T9 U3.19 U3.41 U4.A6 U4.C4 U4.E7 U4.G5 U4.H10 U4.J5 U4.K8 U4.N2 U4.N5 U4.P4 U4.P6 U5.A1 U5.A10 U5.A18 U5.A21 U5.B6 U5.B16 U5.D19 U5.F14 U5.F15 U5.G13 U5.G14 U5.G15 U5.H10 U5.H11 U5.H12 U5.H13 U5.H14 U5.H15 U5.H19 U5.J12 U5.J13 U5.J14 U5.J15 U5.K8 U5.K9 U5.K10 U5.K11 U5.K12 U5.K13 U5.K14 U5.K15 U5.L21 U5.M1 U5.M2 U5.M3 U5.N6 U5.N9 U5.N12 U5.N15 U5.N18 U5.P3 U5.R5 U5.R21 U5.T1 U5.T3 U5.T8 U5.T10 U5.T15 U5.T17 U5.U6 U5.U13 U5.V1 U5.V5 U5.V12 U5.V19 U5.V21 USB1.12 USB1.13 USB1.14 USB1.15 USB1.A1B12 USB1.B1A12 USB2.12 USB2.13 USB2.14 USB2.15 USB2.A1B12 USB2.B1A12 USB3.12 USB3.13 USB3.14 USB3.15 USB3.A1B12 USB3.B1A12 USB4.12 USB4.13 USB4.14 USB4.15 USB4.A1B12 USB4.B1A12 X1.2 X1.4 X2.2 X2.4

Pads without a net: HDMIOUT 14; U1 10 14; U3 18 27 29 31 32 33 34 39; U4 A1 A2 A7 A8 A9 A10 A11 A12 A13 A14 B1 B7 B8 B9 B10 B11 B12 B13 B14 C1 C3 C5 C7 C8 C9 C10 C11 C12 C13 C14 D1 D2 D3 D4 D12 D13 D14 E1 E2 E3 E5 E8 E9 E10 E12 E13 E14 F1 F2 F3 F10 F12 F13 F14 G1 G2 G3 G10 G12 G13 G14 H1 H2 H3 H12 H13 H14 J1 J2 J3 J12 J13 J14 K1 K2 K3 K6 K7 K10 K12 K13 K14 L1 L2 L3 L12 L13 L14 M1 M2 M3 M7 M8 M9 M10 M11 M12 M13 M14 N1 N3 N6 N7 N8 N9 N10 N11 N12 N13 N14 P1 P2 P7 P8 P9 P10 P11 P12 P13 P14; U5 A8 B2 B8 B9 C3 C11 C16 D1 D14 F4 G2 L18 N7 N10 P7 P9 P10 P12 R9 R12 T5 T6 T7 T9 T11 T12 U5 U8 U9 U10 U11 U12 V8 V10; USB1 A8 B8; USB2 A8 B8; USB3 A8 B8; USB4 A8 B8

## Via types
v1: diameter 0.45, hole 0.201, Top Layer to Bottom Layer, 514 vias
v2: diameter 0.457, hole 0.203, Top Layer to Bottom Layer, 125 vias
v3: diameter 0.61, hole 0.305, Top Layer to Bottom Layer, 2 vias
v4: diameter 0.61, hole 0.381, Top Layer to Bottom Layer, 19 vias

## Routing (per net, layer and track width the routed paths; a pad name or vN(x,y) marks a point on that pad's centre or on a via; arc(x,y) is an arc through that point)
1V8: length 71.5
  Top Layer w0.203: v1(35.59,28.37) 35.63,28.37 U5.L14 ; v1(37.6,24.48) 37.6,24.49 37.91,24.8 ; 9.36,15.67 9.35,15.66 v1(9.35,15.16) 9.35,14.64 9.36,14.63 ; U5.D11 40.82,30.33 v1(40.82,30.32) 40.82,30.31 U5.D12
  Top Layer w0.254: R49.2 22.23,8.56 v1(23.6,9.92) ; v1(39.53,25.78) 39.52,25.78 U5.F18 39.4,26.29 39.4,26.72 38.94,27.17 38.33,27.17 U5.H17
  Inner3 w0.457: 39.96,26.68 39.36,27.28 36.81,27.28 36.45,26.92 36.05,26.92 35.59,27.38 v1(35.59,28.37)
  Inner3 w0.635: 39.04,23.03 40.16,24.15 40.16,25.45 39.96,25.65 ; 39.04,23.03 v1(37.6,24.48) ; 39.04,23.03 39.04,21.38 30.18,12.52 26.27,12.52 23.04,9.29 16.57,9.29 v3(14.81,11.05) 13.75,12.11 10.82,12.11 9.35,13.58 v1(9.35,15.16) ; v1(39.53,25.78) 39.83,25.78 39.96,25.65 ; 39.96,25.65 39.96,29.79 40.49,30.32 v1(40.82,30.32)
  Bottom Layer w0.127: v1(35.59,28.37) 35.34,28.11 C16.2
  Bottom Layer w0.203: 41.64,30.32 v1(40.82,30.32)
  Bottom Layer w0.254: 38.43,23.87 38.28,24.02 38.28,25.42 38.64,25.78 v1(39.53,25.78) ; 37.62,23.97 37.62,24.46 v1(37.6,24.48)
3V3: length 56.4
  Top Layer w0.127: v1(25.19,10.02) R33.2 ; v1(2.54,39.87) 2.53,39.88 1.53,39.88 ; D23.2 41.98,13.28
  Top Layer w0.152: U4.P5 U4.N4 U4.P3 ; C3.2 13.08,10.33 v1(13.08,10.87)
  Top Layer w0.178: 52.3,28.11 R19.1 ; 52.3,28.11 v1(52.3,28.16) ; 52.3,28.11 R20.1
  Top Layer w0.203: U4.J10 U4.K9 56.11,37.71 v1(56.11,37.49) ; v1(53.62,35.73) 53.61,35.75 U4.F5 U4.E6 U4.C6 ; v1(58.06,35.21) 61.98,35.21 C76.2 ; v1(58.06,35.21) U4.P3 ; v1(58.06,35.21) 58.07,35.2 ; 56.24,22.86 55.96,23.14 v1(55.58,23.14) 55.56,23.15 54.27,23.15 ; C75.2 C76.2 ; C76.2 C77.2 C81.2 ; R17.1 R24.1 R25.1 R23.1 R22.1 R21.1 47.25,26.64 47.27,26.64 ; 47.27,26.64 47.27,27 v1(47.1,27.17) ; 47.27,26.64 47.6,26.64 48.77,25.47 48.77,24.51 48.93,24.35 U3.11 ; U4.M4 U4.N4 ; U3.25 v1(51.57,18.8) 51.57,18.19 51.57,18.18 ; 40.51,31.3 v1(40.21,31.59) ; v1(54.51,18.26) 54.51,18.56 53.57,19.51 U3.30 ; v1(13.08,10.87) 13.3,11.08 U1.12 ; v1(40.8,27.02) 40.36,27.02 39.86,26.51 U5.E18
  Top Layer w0.254: v1(4.81,32.53) 4.83,32.56 R16.1 ; 40.31,33.07 40.49,33.25 40.51,33.25 40.33,33.07 40.31,33.07 ; 40.31,33.07 v1(40.16,32.91) 39.83,32.91 39.2,33.54 39.2,34.55 ; v1(36.96,33.6) 37.26,33.89 ; v1(35.61,25.78) 35.61,25.79 U5.M18 ; v1(62.97,45.41) R48.2 ; v1(42.68,13.28) 41.98,13.28
  Top Layer w0.305: C28.2 5.36,32.51 R16.1
  Top Layer w0.457: 40.11,26.77 39.88,27 39.88,31.26 40.16,31.54 ; v1(40.21,31.59) 40.16,31.54 ; 40.16,31.54 v1(40.16,32.91)
  Bottom Layer w0.203: C29.2 41.51,27.73 v1(40.8,27.02)
  Bottom Layer w0.254: R50.1 55.48,33.17 v1(55.48,33.07) 54.92,33.63 R51.1
  Bottom Layer w0.305: 40.21,32.76 40.21,32.86 v1(40.16,32.91) ; 40.21,32.76 v1(40.21,31.59) ; 40.21,32.76 39.5,33.47 C27.2
AGND: length 3.3
  Top Layer w0.203: v1(37.6,26.41) 37.91,26.1 U5.H18
  Bottom Layer w0.203: 37.6,25.83 C92.1
  Bottom Layer w0.457: 37.6,26.8 37.6,27.66 37.57,27.68 R32.2 ; C93.1 37.65,25.88 37.6,25.83
GND: length 277.4
  Top Layer w0.089: v1(49.81,37.46) 49.97,37.46 50.72,36.71 U4.A6 ; v1(58.12,34.44) 58.09,34.46 57.36,34.46 U4.N2
  Top Layer w0.102: v1(40.82,25.14) 40.52,25.45 U5.D19 ; X1.2 56.29,29.49 58.25,29.49 v1(58.35,29.59) ; v1(35.31,26.87) 35.07,27.11 33.23,27.11 33.15,27.19 ; v1(20.92,36.66) 20.63,36.95 20.63,37.51 v1(21.14,38.02) v1(21.7,38.58) 22.25,39.14 v1(22.28,39.14) 22.58,39.44 v1(22.91,39.44) v1(23.82,39.44) v1(24.72,39.44) v1(25.67,39.44) v1(26.43,39.44) v1(27.18,39.44) v1(28.03,39.44) v1(28.95,39.44) v1(29.85,39.44) v1(30.85,39.44) v1(31.75,39.44) v1(32.55,39.44) v1(33.56,39.44) 33.84,39.44 v1(34.17,39.11) 34.67,38.6 34.67,37.78 U5.M1 ; v1(33.76,30.48) 33.76,30.73 33.2,31.3 32.7,31.3 ; X2.4 46.05,31.19 C94.2 ; 42.45,31.3 42.49,31.26 v1(43.01,31.26) 42.98,31.29 ; v1(53.19,13.15) D19.3 D19.8 v1(53.19,10.99) ; v1(50.22,13.18) 50.22,12.54 D21.3 D21.8 50.21,11.03 v1(50.22,11.02) ; SIM1.6 v1(2.49,42.08) ; C99.2 v1(44.91,29.28) X2.2 ; 51.57,17.19 53.6,17.19 ; X1.4 54.64,27.68
  Top Layer w0.127: D12.1 35.33,14.92 R30.1 ; v1(52.58,36.19) 52.58,36.18 U4.C4 ; v1(43.31,22.22) 42.45,23.08 42.45,24.15 ; CN1.4 59.78,14.55 v1(58.48,14.55) ; U5.B16 41.8,27.38 v1(42.09,27.1) ; v1(37.88,15.54) D8.1 ; 50.32,21.15 50.37,21.15 U3.41 ; 33.36,34.55 33.65,34.84 34.78,34.84 34.98,35.05 v1(34.98,35.53) 34.99,35.53 35.3,35.85 35.41,35.95 35.41,36.39 U5.M2 U5.M1 ; v1(3.05,45.49) 3.05,45.49 SIM1.9 ; v1(42.09,34.18) 41.8,33.9 ; U5.A1 44.77,37.15 v1(44.83,37.08) ; v1(42.02,21.18) 42.02,20.9 44.51,18.41 C74.2 ; v1(38.82,17.57) 39.4,16.99 D10.1 ; v1(31.17,34.77) 31.18,34.77 31.41,34.55 U5.U6
  Top Layer w0.152: 26.83,32.35 26.39,31.91 26.39,31.19 26.82,30.76 ; 32.71,26.75 33.15,27.19 33.15,27.61 32.71,28.05 ; v1(32.39,36.85) 32.36,36.83 31.73,36.83 31.41,37.15 ; 32.7,35.85 33.02,36.17 33.67,36.17 v1(33.72,36.12) ; v1(35.31,26.87) 35.31,26.75 34.66,26.1 ; U5.U6 32.37,34.21 33.02,34.21 33.36,34.55 ; U4.N5 U4.P6 58.09,36.23 v1(58.09,35.94)
  Top Layer w0.178: 21.23,26.75 21.62,26.36 21.62,25.8 21.23,25.41 21.23,25.15
  Top Layer w0.203: U5.G14 v1(38.88,28.37) ; U5.G14 38.23,28.37 ; U5.G14 38.23,29.02 ; v1(38.88,28.37) U5.F15 ; v1(38.88,28.37) U5.G15 38.23,28.37 ; v1(38.88,28.37) U5.F14 ; 38.23,28.37 U5.H15 v1(37.58,28.37) ; 38.23,28.37 U5.H14 ; C53.1 v1(18.01,36.47) C43.1 v1(18.01,35.43) C36.1 v1(18.01,34.37) C42.1 v1(18.01,33.3) C35.1 C49.1 v1(18.01,31.17) C55.1 C56.1 v1(18.01,29.04) C57.1 C50.1 v1(18.01,26.93) C54.1 v1(18.01,25.88) C48.1 ; U5.K12 36.6,30 v1(36.3,30.31) 36.6,30.61 36.6,30.65 v1(36.3,30.96) 36.6,31.26 36.6,31.32 v1(36.3,31.62) ; U5.K12 v1(36.91,29.69) ; U5.K12 36.6,29.99 v1(36.3,29.69) 36.6,29.38 ; 34.66,33.9 34.33,33.57 33.68,33.57 U5.T8 ; 37.91,31.3 37.91,31.29 v1(37.57,30.96) 37.88,30.65 U5.H11 37.26,30 ; U5.K8 36.6,31.92 v1(36.3,31.62) ; U5.H19 v1(37.6,25.14) 37.6,25.14 ; v1(58.09,35.94) 57.87,35.71 U4.P4 ; v1(36.91,29.69) 37.22,30 37.26,30 ; v1(36.91,29.69) U5.J13 ; v1(36.91,29.69) 36.6,29.38 ; U5.A18 43.54,25.01 43.54,24.15 v1(44.2,23.49) ; v1(34.32,28.37) 34.33,28.37 34.66,28.05 ; v1(30.03,37.03) 29.9,37.16 U2.A9 ; v1(30.03,37.03) v1(29.45,36.46) ; v1(30.03,37.03) 31.29,37.03 31.41,37.15 ; v1(55.11,37.21) U4.G5 U4.E7 ; v1(55.11,37.21) U4.J5 ; v1(55.11,37.21) U4.K8 U4.H10 ; v1(25.13,34.21) 25.13,34.45 25.82,35.14 26.44,35.14 26.83,34.75 ; 37.26,28.05 v1(37.58,28.37) ; v1(37.58,28.37) U5.H14 ; v1(37.58,28.37) 37.26,28.7 37.58,29.02 ; 36.93,28.37 U5.K14 36.93,29.02 ; 36.93,28.37 U5.J15 ; 36.93,28.37 U5.J14 36.93,29.02 ; 36.93,28.37 U5.K15 ; 37.58,29.67 37.26,29.35 ; 37.58,29.67 U5.H13 ; 37.58,29.67 U5.H12 ; 37.58,29.67 37.26,30 ; 37.26,29.35 37.58,29.02 ; 37.26,29.35 36.93,29.02 ; v1(36.3,31.62) 36.28,31.62 ; 36.93,29.02 U5.K13 36.6,29.38 ; U3.19 50.32,21.15 v2(50.58,21.41) ; 9.36,13.57 9.36,11.49 C12.1 9.33,10.03 9,9.7 R43.2 7.75,9.11 USB3.B1A12 ; 30.43,29.05 C32.1 29.8,26.44 28.4,26.44 v1(28.05,26.79) 28,26.75 27.63,26.75 ; U5.H13 37.58,29.02 ; U5.H13 38.23,29.02 ; v1(13.31,13.08) 13.31,13.08 U1.9 ; U5.H14 38.23,29.02 ; U5.H14 37.58,29.02 ; U5.G13 38.23,29.02 ; v1(32.39,36.85) 32.69,37.15 32.71,37.15 ; v1(34.95,29.69) 34.95,29.7 34.66,30 ; 31.41,24.15 31.73,24.47 31.73,25.12 U5.V19 ; v1(22.44,35.96) 21.62,35.96 21.23,36.35 ; v1(22.43,31.15) 22.03,30.75 ; U5.V12 U5.U13
  Top Layer w0.229: U2.T1 20.9,24.84 v1(20.86,24.84) ; v1(20.76,34.34) 20.8,34.34 U2.D1
  Top Layer w0.254: v1(29.45,36.46) 27.72,36.46 U2.B9 ; 53.95,7.51 v1(53.94,7.53) HDMIOUT.2 ; USB4.A1B12 9.53,5.82 9.35,5.82 ; 33.36,24.15 32.47,23.26 v1(32.47,22.25) v1(31.48,22.25) v1(30.28,22.25) 29.14,22.25 v1(29.11,22.27) v1(28.02,22.27) v1(26.95,22.27) v1(25.84,22.27) 24.59,22.27 v1(24.57,22.25) 23.58,22.25 v1(23.52,22.3) 23.24,22.3 v1(22.33,23.21) v1(21.26,24.28) 20.86,24.68 v1(20.86,24.84) ; v1(35.41,18.69) 35.41,19.36 C88.1 ; v1(52.43,7.51) 52.44,7.53 HDMIOUT.5 ; 34.01,35.85 33.73,36.12 v1(33.72,36.12) ; R44.1 12.04,8.68 12.53,8.68 13.1,9.25 C3.1 ; 34.66,31.95 34.66,31.95 v1(34.33,32.27) 34.01,32.6 U5.T8 ; v1(56.37,27.68) 54.64,27.68 ; v1(50.93,7.51) 50.94,7.52 HDMIOUT.8 ; HDMIOUT.17 46.44,7.77 v1(46.18,7.51) ; R46.2 16.89,7.54 USB4.B1A12 17.81,5.82 17.99,5.82 ; C90.1 37.48,20.71 v1(37.75,20.98) ; v1(35.82,23.01) 35.82,24.01 35.95,24.15 ; 31.41,24.15 31.22,24.33 28.79,24.33 27.97,25.15 ; 32.04,33.9 U5.U6 ; v1(49.43,7.49) 49.43,9.23 HDMIOUT.11 49.44,7.5 v1(49.43,7.49)
  Top Layer w0.305: 26.83,32.35 v1(27.23,32.35) 27.63,32.35 27.63,33.15 ; 21.23,28.35 v1(20.82,28.76) ; 21.23,36.35 20.92,36.66 v1(20.92,36.66) ; 21.23,34.75 21.23,33.95 22.03,33.95 ; 26.83,34.75 26.83,33.95 ; 27.63,25.15 27.97,25.15 v1(27.98,25.16) ; 21.23,32.35 v1(20.75,32.35) ; 22.83,36.35 v1(22.44,35.96) ; v1(28.31,28.73) 28.01,28.73 27.63,28.35
  Bottom Layer w0.102: v1(35.61,21.23) 34.55,20.16 25.76,20.16 24.18,18.59 v1(24.18,13)
  Bottom Layer w0.127: v1(58.48,14.55) 57.2,14.55 v1(57.15,14.6) v1(56.48,15.28) v1(55.91,15.85) v1(54.87,15.85) v1(53.95,15.85) 53.9,15.9 46.94,15.9 44.89,17.95 44.89,20.65 v1(43.31,22.22) ; v1(35.82,23.01) 33.75,20.94 32.86,20.94
  Bottom Layer w0.203: C62.1 C63.1 26.95,31.85 C41.1 ; 30.28,27.2 30.28,26.26 30.26,26.23 ; 39,28.37 v1(38.88,28.37) ; 42.65,30.32 43.01,30.68 v1(43.01,31.26) ; C22.1 C21.1 C23.1 38.74,33.09 v1(37.93,33.09)
  Bottom Layer w0.229: C41.1 27.23,32.02 v1(27.23,32.35) ; R11.1 19.97,29.89 C60.1 C33.1 C31.1 C37.1 C61.1 ; C62.1 26.14,30.04 C58.1 27.91,29.13 v1(28.31,28.73)
  Bottom Layer w0.254: v1(40.82,25.14) 41.05,24.91 41.05,24.38 ; v1(33.76,30.48) 34.17,30.48
  Bottom Layer w0.33: v1(31.17,34.77) 31.17,34.13 C65.1 ; C51.1 27.18,39.23 v1(27.18,39.44) ; C44.1 25.75,39.36 v1(25.67,39.44)
  Bottom Layer w0.381: v1(34.33,32.27) 34.17,32.11 C20.1 C18.1 ; C26.1 42.52,27.53 v1(42.09,27.1) 42.5,26.69 C96.1 ; C24.1 37.85,29.29 37.58,29.02 ; v1(28.05,26.79) 28.05,28.14 C58.1
  Bottom Layer w0.457: R32.1 39.42,27.83 v1(38.88,28.37) ; 39.35,28.72 39,28.37
  vias: v1(5.77,43.71) v1(8.28,41.47) v1(8.28,40.25) v1(8.28,38.86) v1(8.28,37.78) v1(11.79,15.11) v1(12.2,43.42) v1(13.29,13.92) v1(13.7,13.48) v1(13.7,13.48) v1(14.08,13.92) v1(14.1,13.1) v1(15.96,11.1) v1(19.13,6.19) v1(20.63,37.51) v1(20.76,6.19) v1(30.39,31.56) v1(31.73,29.66) v1(35.82,14.98) v1(45.14,25.57) v1(49.03,33.8) v1(51.72,28.67) v1(52.94,31.42) v1(53.04,28.67) v1(54.08,31.26) v1(55.83,31.72) v1(56.49,24.63) v1(57.28,27.68) v1(57.46,24.71) v1(57.66,30.98) v1(57.64,26.44) v1(58.17,27.89) v1(58.25,27.07) v1(58.25,22.07) v1(58.32,28.88) v1(58.3,23.11) v1(58.4,24.71) v1(58.53,30.58) v1(58.63,23.9) v1(58.73,26.44) v1(59.03,29.87) v1(59.19,27.96) v1(59.27,27.07) v1(59.24,22.83) v1(59.29,21.66) v1(59.54,28.95) v1(59.64,23.72) v1(59.91,26.41) v1(60,30.6) v1(60.15,29.87) v1(60.33,29) v1(60.3,27.99) v1(60.41,21.92) v1(60.51,27.07) v1(60.53,22.83) v1(60.74,23.87) v1(60.81,24.89) v1(61.27,29.01) v1(61.27,28.04) v1(61.37,30.27) v1(61.57,30.93) v1(61.83,24.13) v1(61.78,23.11) v1(62.23,29.46) v1(62.74,30.43) v1(63.07,24.05) v1(63.15,23.01) v1(63.35,30.88) v1(63.48,29.56) v1(63.96,30.48) v1(64.29,24.05) v1(64.47,29.64) v1(64.42,22.91) v2(3.13,47.54) v2(3.13,35.35) v2(3.13,26.21) v2(3.13,23.16) v2(3.13,20.11) v2(3.13,17.06) v2(3.13,14.02) v2(3.13,10.97) v2(3.13,7.92) v2(6.18,53.64) v2(6.18,50.59) v2(6.18,47.54) v2(6.18,20.11) v2(6.18,4.87) v2(6.18,1.82) v2(9.22,47.54) v2(9.22,44.5) v2(9.22,29.26) v2(9.22,26.21) v2(9.22,7.92) v2(12.27,47.54) v2(12.27,35.35) v2(12.27,32.3) v2(12.27,29.26) v2(12.27,26.21) v2(12.27,23.16) v2(12.27,1.82) v2(15.27,33.07) v2(15.32,47.54) v2(15.32,44.5) v2(15.32,38.4) v2(15.32,35.35) v2(15.32,26.21) v2(15.32,1.82) v2(16.84,36.52) v2(16.95,34.21) v2(18.19,21.38) v2(18.37,44.5) v2(18.37,38.4) v2(18.37,20.11) v2(21.42,14.02) v2(24.46,47.54) v2(24.46,7.92) v2(24.46,4.87) v2(24.46,1.82) v2(27.16,17.62) v2(27.51,47.54) v2(27.51,4.87) v2(27.51,1.82) v2(30.56,47.54) v2(30.56,44.5) v2(30.56,7.92) v2(30.71,17.62) v2(33.43,13.64) v2(33.61,47.54) v2(33.61,4.87) v2(36.66,4.87) v2(39.12,48.89) v2(41.13,6.96) v2(41.2,9.65) v2(42.75,47.54) v2(42.75,14.02) v2(42.75,10.97) v2(42.75,4.87) v2(45.8,44.5) v2(45.8,1.82) v2(48.85,47.54) v2(48.85,44.5) v2(48.85,38.4) v2(48.85,20.11) v2(48.85,17.06) v2(48.85,1.82) v2(50.58,23.69) v2(50.58,22.93) v2(50.58,22.17) v2(51.34,23.69) v2(51.34,22.93) v2(51.34,22.17) v2(51.34,21.41) v2(51.9,1.82) v2(52.1,23.69) v2(52.1,22.93) v2(52.1,22.17) v2(52.1,21.41) v2(52.86,23.69) v2(52.86,22.93) v2(52.86,22.17) v2(52.86,21.41) v2(54.94,47.54) v2(54.94,44.5) v2(54.94,41.45) v2(54.94,32.3) v2(54.94,17.06) v2(54.94,10.97) v2(54.94,7.92) v2(54.94,1.82) v2(57.99,47.54) v2(57.99,44.5) v2(57.99,41.45) v2(57.99,32.3) v2(57.99,20.11) v2(57.99,14.02) v2(57.99,10.97) v2(57.99,4.87) v2(61.04,44.5) v2(61.04,41.45) v2(61.04,38.4) v2(61.04,32.3) v2(61.04,23.16) v2(61.04,17.06) v2(61.04,14.02) v2(61.04,7.92) v2(64.09,53.64) v2(64.09,50.59) v2(64.09,47.54) v2(64.09,44.5) v2(64.09,41.45) v2(64.09,38.4) v2(64.09,35.35) v2(64.09,32.3) v2(64.09,17.06) v2(64.09,14.02) v2(64.09,7.92) v2(64.09,4.87)
VCC_DRAM: length 136.3
  Top Layer w0.152: v1(27.24,30.34) 27.22,30.34 26.83,29.95 ; 22.03,29.95 21.85,29.95 21.45,29.55 20.74,29.55 v1(20.45,29.26) ; L3.2 12.73,17.05 12.73,16.05 13.3,15.48 U1.4 ; 27.63,35.55 27.52,35.55
  Top Layer w0.203: 35.6,29.64 U5.L12 35.65,30.3 35.61,30.3 ; 35.6,29.64 v1(35.59,29.64) ; 35.6,29.64 35.66,29.64 U5.L13 35.61,29 v1(35.59,29) ; C32.2 29.38,27.11 29,27.11 ; 35.61,31.64 35.95,31.3 35.9,31.3 v1(35.56,30.96) 35.64,30.96 U5.L11 35.61,30.3 ; 35.61,31.64 35.65,31.64 U5.L9 ; 35.61,31.64 v1(35.56,31.64) ; 29,27.11 v1(28.76,26.87) ; 29,27.11 28.55,27.56 U2.N9 ; 28.41,35.15 28.02,35.55 27.63,35.55 ; 35.61,30.3 v1(35.56,30.3) ; 21.23,33.15 21.63,32.75 21.63,31.95 22.03,31.55
  Top Layer w0.229: v1(20.4,33.14) 21.21,33.14 U2.F1 ; U2.C1 20.86,35.2 v1(20.68,35.2) ; U2.R1 20.94,25.68 v1(20.7,25.68)
  Top Layer w0.254: U2.N1 20.88,27.56 v1(20.73,27.71) ; 26.03,32.35 v1(25.6,32.35) ; v1(28.62,25.95) 28.62,25.96 U2.R9
  Top Layer w0.305: 27.63,31.55 v1(28.55,31.55) 29.47,31.55 30.46,32.54 v1(30.46,34.64) ; 27.63,33.95 27.63,34.75 ; 21.23,37.15 v1(21.62,36.76) 22.03,36.35 ; 21.23,35.55 v1(21.64,35.14) 22.03,34.75 ; 28.41,35.15 28.98,35.15 v1(29.39,34.74)
  Top Layer w0.33: C55.2 C56.2 20.13,29.58 v1(20.45,29.26) ; v1(29.39,34.74) 29.39,34.44 28.91,33.96 U2.E9 ; C57.2 C50.2 19.27,27.71 v1(20.73,27.71) ; C43.2 C53.2 19.77,37.01 U2.C1 ; U2.A8 26.82,37.41 v1(26.34,37.89) ; v1(20.4,33.14) 19.82,33.14 19.44,32.77 C35.2 C49.2 ; v1(20.7,25.68) 19.36,25.68 C48.2 C54.2 ; C42.2 C36.2 20.37,34.89 v1(20.68,35.2)
  Inner3 w0.584: v4(10.06,19.27) v4(10.06,19.99) 10.06,22.32 15.85,28.11 ; 19.71,32.46 17.1,32.46 15.85,31.21 15.85,28.11 ; 19.71,32.46 19.08,33.09 19.08,34.57 19.71,35.2 v1(20.68,35.2) 21.62,36.14 v1(21.62,36.76) ; 19.71,32.46 v1(20.4,33.14) 20.76,33.5 22.76,33.5 23.91,32.35 v1(25.6,32.35) 26.4,31.55 v1(28.55,31.55) 29.51,31.55 30.48,30.58 32.26,30.58 32.92,31.24 35.29,31.24 v1(35.56,30.96) ; 19.31,28.11 20.32,28.11 v1(20.73,27.71) 20.73,25.7 v1(20.7,25.68) ; 19.31,28.11 15.85,28.11 ; 19.31,28.11 v1(20.45,29.26)
  Bottom Layer w0.203: v1(35.56,30.3) 35.39,30.48 C18.2 35.56,30.86 v1(35.56,30.96) 35.56,31.09 C20.2 35.39,31.47 v1(35.56,31.64)
  Bottom Layer w0.229: v1(25.6,32.35) 26.04,31.91 C41.2 ; C63.2 27.39,30.93 ; v1(20.4,33.14) R10.2 ; v1(28.62,25.95) 28.91,26.23 29.24,26.23 ; 20.4,33.42 20.4,33.5 20.05,33.85
  Bottom Layer w0.33: 20.07,28.88 20.05,28.85 C31.2 ; 20.07,28.88 C33.2 ; 20.07,28.88 v1(20.45,29.26) ; v1(20.68,35.2) 20.53,35.2 C64.2 C34.2 20.4,33.42 v1(20.4,33.14) ; v1(20.68,35.2) 20.93,35.45 21.33,35.45 v1(21.64,35.14) ; v1(20.68,35.2) 20.25,35.63 C40.2 20.02,35.66 C46.2 ; C31.2 20.55,27.89 v1(20.73,27.71) ; C31.2 C37.2 C61.2 ; C61.2 20.32,25.68 v1(20.7,25.68) ; C61.2 C38.2 ; 26.91,37.95 26.86,37.89 v1(26.34,37.89) 26.29,37.95 ; C47.2 C65.2 30.46,34.13 v1(30.46,34.64)
  Bottom Layer w0.381: 29.24,27.17 C39.2 C45.2 C52.2 29.32,29.13 29.32,31.39 29.16,31.55 v1(28.55,31.55) 28,31.55 27.39,30.93 ; 29.24,27.17 29.24,26.23 ; 29.24,27.17 28.93,26.87 v1(28.76,26.87) ; C63.2 27.24,30.75 v1(27.24,30.34)
  Bottom Layer w0.584: v1(30.46,34.64) 30.31,34.49 29.65,34.49 v1(29.39,34.74) ; v1(21.62,36.76) 21.62,37.26 22.25,37.89 v1(26.34,37.89)
VDD_CPU: length 11.6
  Top Layer w0.152: L2.2 17.74,16.3 15.35,16.3 14.5,15.45 U1.1
  Top Layer w0.203: 37.26,31.3 36.94,30.98 v1(36.93,30.98) 37.26,30.65 37.26,30.65 ; 37.26,31.3 v1(37.58,31.62) U5.H9 v1(37.58,32.27) ; 37.26,31.3 37.26,31.3 v1(36.93,31.63) 36.93,31.63 v1(37.58,32.27) ; U5.L8 36.3,32.94 36.91,32.94 37.26,32.6 v1(37.58,32.27) ; v1(37.58,32.27) U5.H8
  Bottom Layer w0.381: 37.08,30.53 36.93,30.69 v1(36.93,30.98) ; v1(37.58,32.27) 37.09,32.76 C25.2
  vias: v4(18.42,17.32) v4(19.36,17.32) v4(20.19,17.32) v4(21.15,17.32)
VDD_GPU: length 11.4
  Top Layer w0.152: 17.77,11.34 17.33,11.78 16.01,11.78 15.73,12.06 15.73,12.57 15.61,12.68 U1.16
  Top Layer w0.203: v1(38.87,29.66) 38.87,29.66 U5.F12 ; v1(38.87,29.66) 39.18,29.35 U5.F13 ; v1(38.87,29.66) 38.87,29.68 U5.G12 38.55,30.03 v1(38.28,30.3) 38.55,30.57 ; 38.61,31.3 38.59,31.3 38.55,31.26 ; 38.61,31.3 38.55,31.35 ; 38.61,31.3 39.2,31.3 ; 38.55,31.98 38.53,31.98 v1(38.26,32.25) 38.53,32.53 38.55,32.53 U5.G8 U5.F8 ; 38.55,31.98 38.55,31.89 ; 38.55,31.98 38.59,31.95 38.61,31.95 ; 38.55,30.57 38.59,30.61 U5.G11 ; 38.55,30.57 U5.G11 ; 38.55,31.89 38.61,31.95 ; 38.55,31.89 v1(38.28,31.62) 38.55,31.35 ; 38.61,31.95 U5.F9 ; 38.55,31.35 38.55,31.26 ; U5.G11 38.55,30.71 38.5,30.71 v1(38.26,30.96) 38.55,31.26 ; U5.G11 38.52,30.68 ; U5.G11 U5.F11
  vias: v4(17.56,10.59) v4(18.57,10.59) v4(19.54,10.59) v4(20.48,10.59) v4(21.34,10.59)
AP_REG_ON: length 30.7
  Top Layer w0.115: v1(40.82,32.25) 40.85,32.25 41.16,31.95
  Top Layer w0.127: v1(55.22,21.31) 55.17,21.36 55.17,22.12 54.94,22.35 54.27,22.35
  Bottom Layer w0.102: v1(55.22,21.31) 55.25,21.28 55.25,20.39 54.92,20.06 50.27,20.06 49.66,19.45 48.11,19.45 47.22,20.34 47.22,22.25 46.49,22.98 46.49,24.3 46.21,24.58 46.21,27.71 47.05,28.55 47.05,31.36 46.18,32.23 42.07,32.23 41.71,31.88 41.2,31.88 v1(40.82,32.25)
BT_RSTN: length 25.4
  Top Layer w0.102: 41.16,31.3 40.83,31.62 v1(40.82,31.62) ; U3.23 50.77,18.99 49.64,17.85 48.59,17.85 v1(48.47,17.98)
  Bottom Layer w0.102: v1(48.47,17.98) 47.68,18.77 47.68,19.48 46.94,20.21 46.94,22.07 46.18,22.83 46.18,24.18 45.88,24.48 45.88,27.83 46.71,28.67 46.71,31.24 46.05,31.9 42.22,31.9 41.81,31.49 40.95,31.49 v1(40.82,31.62)
D0+: length 33.5
  Top Layer w0.127: 37.26,24.8 36.97,24.51 v1(36.96,24.51) ; 26.94,6.73 26.94,8.04 v1(26.88,8.1)
  Top Layer w0.137: USB1.A6 25.94,5.81 26.09,5.66 26.78,5.66 26.93,5.81 26.93,6.72 26.94,6.73
  Bottom Layer w0.127: v1(36.96,24.51) 36.64,24.49 36.47,24.33 36.47,23.5 36.83,23.14 36.83,21.38 35.08,19.63 26.24,19.63 24.87,18.26 24.87,11.98 26.67,10.17 26.67,8.25 26.83,8.1 v1(26.88,8.1)
  Bottom Layer w0.254: v1(26.88,8.1) 27.11,7.86 D11.1
D0-: length 33
  Top Layer w0.127: 37.26,25.45 37.26,25.44 v1(36.94,25.12)
  Top Layer w0.137: 26.29,7.72 v1(26.29,8.1) ; 26.29,7.72 26.17,7.84 25.68,7.84 25.44,7.6 USB1.B7 ; 26.29,7.72 26.45,7.57 26.45,6.74 USB1.A7
  Bottom Layer w0.127: v1(26.29,8.1) 26.45,8.25 26.45,10.08 24.64,11.88 24.64,18.35 26.15,19.86 34.98,19.86 36.61,21.48 36.61,23.04 36.24,23.41 36.24,24.42 v1(36.94,25.12)
  Bottom Layer w0.254: v1(26.29,8.1) 25.96,7.76 D9.1
D1+: length 37.4
  Top Layer w0.127: USB2.A6 5.94,25.54 5.77,25.37 5.77,24.68 5.92,24.53 6.7,24.53 USB2.B6 7.92,24.55 v1(8.18,24.81) 8.72,25.35 12.05,25.35 14.18,23.21 21.32,23.21 23.4,21.13 33.76,21.13 35.23,22.6 35.23,24.72 35.3,24.8
  Bottom Layer w0.203: v1(8.18,24.81) 8.06,24.69 D14.1
D1-: length 36.4
  Top Layer w0.127: 7.9,25.26 8.2,25.26 8.54,25.6 12.12,25.6 14.28,23.44 21.42,23.44 23.5,21.36 33.67,21.36 34.98,22.67 34.98,25.12 U5.M19 ; 7.9,25.26 v1(7.9,25.83) 7.68,26.04 USB2.B7 ; 7.9,25.26 7.68,25.05 USB2.A7
  Bottom Layer w0.254: v1(7.9,25.83) 7.89,25.84 D13.1
D2+: length 46.2
  Top Layer w0.127: v1(35.67,24.53) 35.93,24.8 35.95,24.8 ; USB3.A6 5.87,12.59 5.67,12.39 5.67,11.76 5.83,11.59 USB3.B6 8.22,11.59 v1(8.28,11.65)
  Bottom Layer w0.127: v1(8.28,11.65) 8.28,11.72 8.44,11.88 8.94,11.88 9.62,12.57 9.62,13.21 8.49,14.35 8.49,20.09 10.92,22.52 22.02,22.52 23.3,21.23 33.46,21.23 35.39,23.16 35.39,24.25 v1(35.67,24.53)
  Bottom Layer w0.203: v1(8.28,11.65) 8.12,11.49 D18.1
D2-: length 45.7
  Top Layer w0.127: 7.78,12.21 7.65,12.09 6.72,12.09 USB3.A7 ; 7.78,12.21 7.95,12.39 v1(8.28,12.39) ; 7.78,12.21 7.78,12.92 7.61,13.09 6.72,13.09 ; v1(35.64,25.12) 35.95,25.43 U5.L19
  Bottom Layer w0.127: v1(35.64,25.12) 35.16,24.63 35.16,23.31 33.3,21.46 23.4,21.46 22.11,22.75 10.82,22.75 8.26,20.18 8.26,14.25 9.39,13.12 9.39,12.66 8.84,12.11 8.38,12.11 8.28,12.21 v1(8.28,12.39)
  Bottom Layer w0.203: D17.1 8.03,12.64 v1(8.28,12.39)
D3+: length 41.1
  Top Layer w0.127: v1(14.41,8.23) 14.3,8.12 14.3,7.51 14.42,7.4 14.42,6.73 14.41,6.72 14.41,5.84 14.25,5.69 13.57,5.69 13.42,5.83 USB4.A6 ; 36.6,24.8 36.5,24.69 36.5,22.22 v1(36.05,21.76)
  Bottom Layer w0.127: v1(36.05,21.76) 35.89,21.92 35.59,21.92 34.17,20.49 25.4,20.49 23.75,18.84 23.75,11.48 21.82,9.55 14.71,9.55 14.58,9.41 14.58,9.37 14.25,9.04 14.25,9.03 14.24,8.84 14.42,8.64 v1(14.41,8.23)
  Bottom Layer w0.203: D16.1 14.61,8.02 v1(14.41,8.23)
D3-: length 40.7
  Top Layer w0.127: 13.92,7.59 13.77,7.74 13.08,7.74 12.92,7.58 USB4.B7 ; 13.92,7.59 13.92,6.74 USB4.A7 ; 13.92,7.59 13.92,8.12 v1(13.8,8.25) ; v1(36.02,22.4) 36.28,22.65 36.28,25.12 U5.K19
  Bottom Layer w0.127: v1(36.02,22.4) 35.79,22.17 35.49,22.17 34.05,20.72 25.31,20.72 23.52,18.94 23.52,11.58 21.72,9.77 14.62,9.77 14.35,9.51 14.35,9.46 14.02,9.13 14.02,9.04 14.01,8.85 13.81,8.67 v1(13.8,8.25)
  Bottom Layer w0.203: v1(13.8,8.25) 13.46,7.92 D15.1
EPHY_RTX: length 1.3
  Top Layer w0.203: 42.12,25.14 v1(42.11,25.14) U5.B19
  Bottom Layer w0.254: v1(42.11,25.14) 41.96,25 41.96,24.38
EPHY_RXN: length 25.9
  Top Layer w0.127: 41.8,24.15 41.8,22.2 43.44,20.57 v1(43.44,20.32) ; v1(58.32,12.19) 58.35,12.19 58.58,12.42 59.49,12.42 CN1.6
  Bottom Layer w0.127: v1(43.44,20.32) 43.49,20.37 43.77,20.37 44.2,19.93 44.2,17.61 46.67,15.13 54.32,15.13 56.86,12.59 57.7,12.59 57.89,12.6 v1(58.32,12.19)
EPHY_RXP: length 26.4
  Top Layer w0.127: 41.8,24.8 42.12,24.48 42.12,22.32 43.59,20.85 v1(43.97,20.85) ; CN1.5 59.46,12.98 58.58,12.98 v1(58.3,13.25)
  Bottom Layer w0.127: v1(58.3,13.25) 57.89,12.83 57.7,12.82 56.95,12.82 54.41,15.36 46.77,15.36 44.43,17.7 44.43,20.09 43.84,20.68 43.84,20.72 v1(43.97,20.85)
EPHY_TXN: length 23.5
  Top Layer w0.127: CN1.3 59.43,16.23 58.42,16.23 v1(58.27,16.07) ; v1(44.25,22.12) 44.25,22.3 42.73,23.81 42.73,24.52 42.45,24.8
  Bottom Layer w0.127: v1(58.27,16.07) 57.97,16.38 47.2,16.38 45.32,18.27 45.32,20.7 44.91,21.11 44.91,21.64 44.43,22.12 v1(44.25,22.12)
